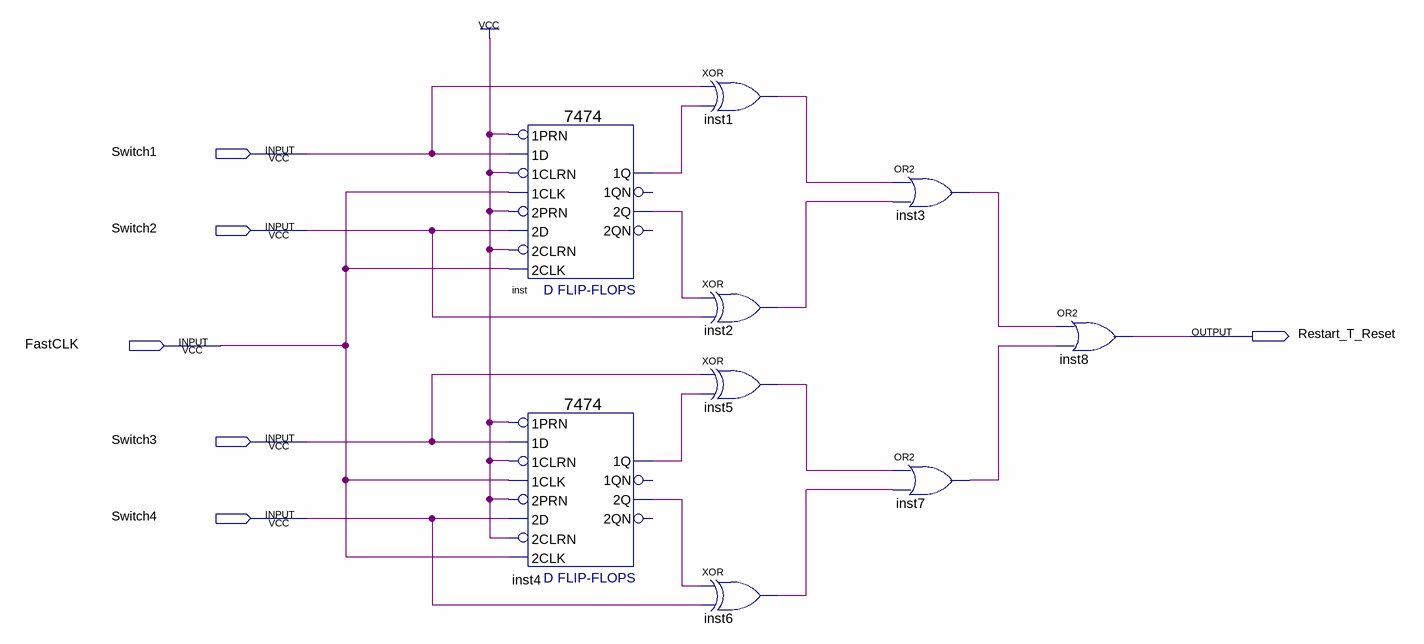
[diagram p0: schematic sheet]
// Quartus schematic SwitchChangeDetector.bdf as structural Verilog: 9 symbols, 6 pins
module SwitchChangeDetector (
  input  Switch1,
  input  Switch2,
  input  FastCLK,
  input  Switch3,
  input  Switch4,
  output Restart_T_Reset
);

  wire inst1_out, inst2_out, inst3_out, inst4_1q, inst4_2q, inst5_out, inst6_out, inst7_out, inst_1q, inst_2q;

  \7474  inst (
    .\2D (Switch2), .\2PRN (1'b1), .\1CLK (FastCLK), .\1D (Switch1), .\1PRN (1'b1), .\2CLK (FastCLK),
    .\2CLRN (1'b1), .\1CLRN (1'b1), .\2Q (inst_2q), .\1Q (inst_1q));  // open: 1QN, 2QN
  \7474  inst4 (
    .\2D (Switch4), .\2PRN (1'b1), .\1CLK (FastCLK), .\1D (Switch3), .\1PRN (1'b1), .\2CLK (FastCLK),
    .\2CLRN (1'b1), .\1CLRN (1'b1), .\2Q (inst4_2q), .\1Q (inst4_1q));  // open: 1QN, 2QN
  xor inst1 (inst1_out, Switch1, inst_1q);
  xor inst2 (inst2_out, inst_2q, Switch2);
  xor inst5 (inst5_out, Switch3, inst4_1q);
  xor inst6 (inst6_out, inst4_2q, Switch4);
  or inst3 (inst3_out, inst1_out, inst2_out);
  or inst7 (inst7_out, inst5_out, inst6_out);
  or inst8 (Restart_T_Reset, inst3_out, inst7_out);
endmodule
